# EAGLE design thpg (EAGLE 9.3.0)
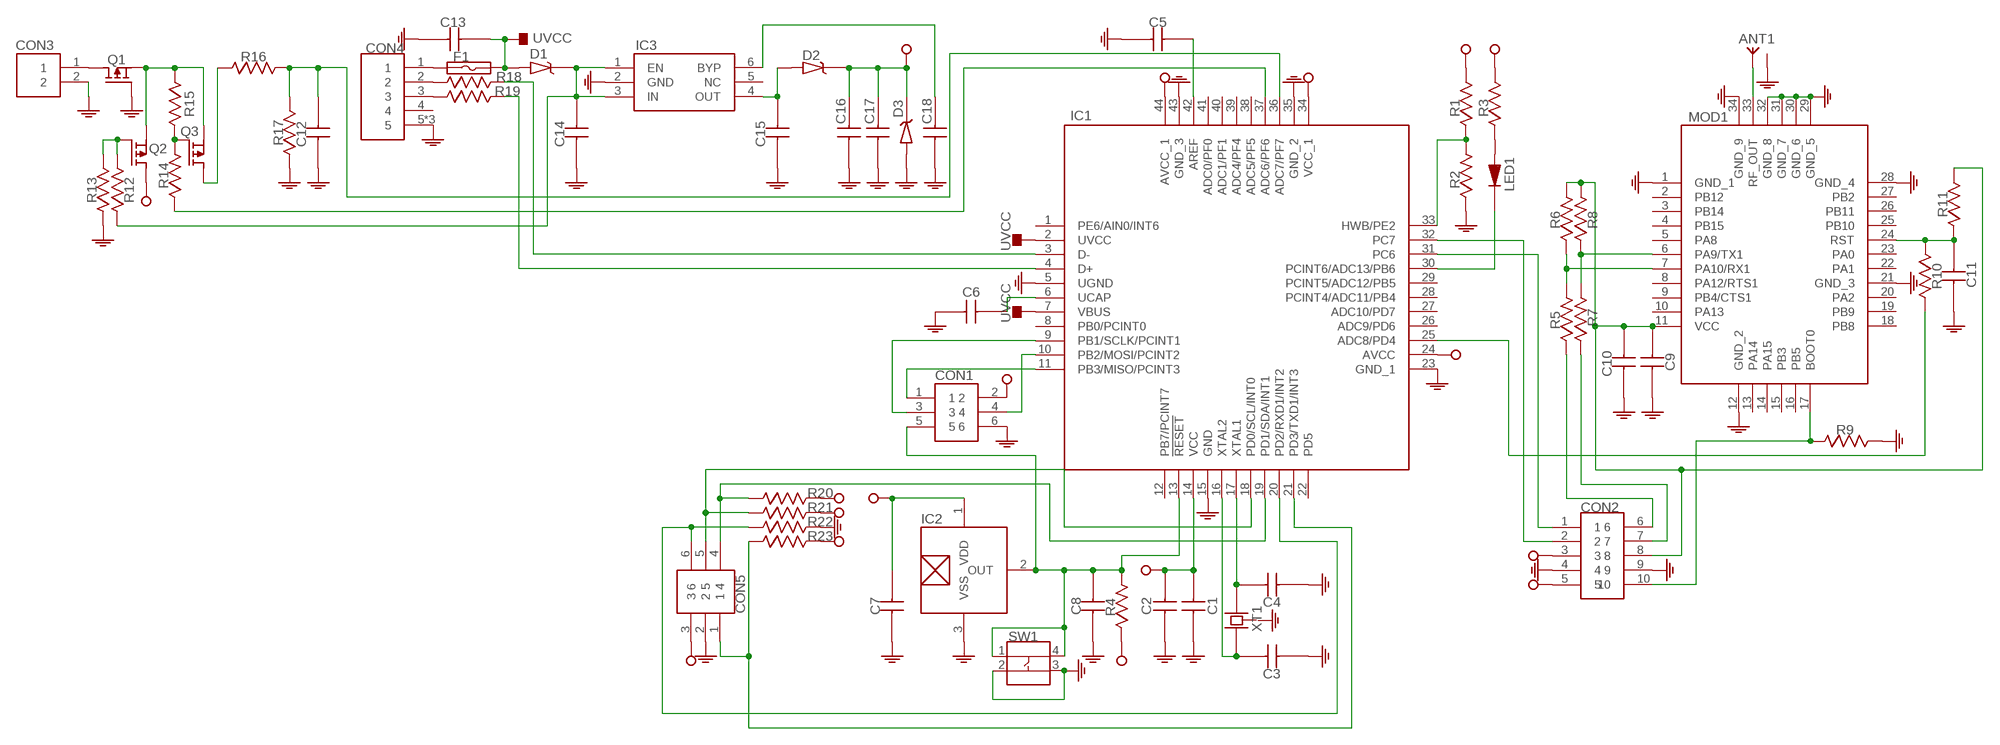
[diagram p0: schematic, sheet 1]

## Parts
ANT1  SMA-RF  [SMA-RF]
C1  CAPACITOR-0603  [0603]
C2  CAPACITOR-0603  [0603]
C3  CAPACITOR-0603  [0603]
C4  CAPACITOR-0603  [0603]
C5  CAPACITOR-0603  [0603]
C6  CAPACITOR-0603  [0603]
C7  CAPACITOR-0603  [0603]
C8  CAPACITOR-0603  [0603]
C9  CAPACITOR-0603  [0603]
C10  CAPACITOR-0603  [0603]
C11  CAPACITOR-0603  [0603]
C12  CAPACITOR-0603  [0603]
C13  CAPACITOR-0603  [0603]
C14  CAPACITOR-0805  [0805]
C15  CAPACITOR-0805  [0805]
C16  CAPACITOR-0603  [0603]
C17  CAPACITOR-0603  [0603]
C18  CAPACITOR-0603  [0603]
CON1  ISP  [ISP]
CON2  HEADER-10P-2R-DIP-2_54MM  [HEADER-10P-2R-DIP-2_54MM]
CON3  JST-PH-2-2.0MM  [JST-PH-2-2.0MM]
CON4  USB-MICRO-DIP-VER  [USB-MICRO-DIP-VER]
CON5  HEADER-6P-2R-DIP-2_54MM  [HEADER-6P-2R-DIP-2_54MM]
D1  DIODE-SCHOTTKY  [SOD123-DIODE]
D2  DIODE-SCHOTTKY  [SOD123-DIODE]
D3  ZENER-SOD123  [SOD123-DIODE]
F1  FUSE-0805  [0805]
IC1  ATMEGA32U4-MU  [QFN-44]
IC2  S-5712-SOT23-3  [SOT23-3]
IC3  MIC5219-VDFN-6  [VDFN-6]
LED1  LED-0603  [LED-0603]
MOD1  RAK811  [RAK811]
Q1  P-MOSFET  [SOT23-3]
Q2  P-MOSFET  [SOT23-3]
Q3  P-MOSFET  [SOT23-3]
R1  RESISTOR-0603  [0603]
R2  RESISTOR-0603  [0603]
R3  RESISTOR-0603  [0603]
R4  RESISTOR-0603  [0603]
R5  RESISTOR-0603  [0603]
R6  RESISTOR-0603  [0603]
R7  RESISTOR-0603  [0603]
R8  RESISTOR-0603  [0603]
R9  RESISTOR-0603  [0603]
R10  RESISTOR-0603  [0603]
R11  RESISTOR-0603  [0603]
R12  RESISTOR-0603  [0603]
R13  RESISTOR-0603  [0603]
R14  RESISTOR-0603  [0603]
R15  RESISTOR-0603  [0603]
R16  RESISTOR-0603  [0603]
R17  RESISTOR-0603  [0603]
R18  RESISTOR-0603  [0603]
R19  RESISTOR-0603  [0603]
R20  RESISTOR-0603  [0603]
R21  RESISTOR-0603  [0603]
R22  RESISTOR-0603  [0603]
R23  RESISTOR-0603  [0603]
SW1  BUTTON-4P-SMD-5X5  [BUTTON-4P-SMD-5X5]
XT1  CRYSTAL-5032-4P  [CRYSTAL-5032-4P]

## Nets
GND: ANT1.2(GND) ANT1.3(GND) ANT1.4(GND) ANT1.5(GND) C1.1 C2.1 C3.1 C4.1 C5.1 C6.1 C7.1 C8.1 C9.1 C10.1 C11.1 C12.1 C13.1 C14.1 C15.1 C16.1 C17.1 C18.1 CON1.6 CON2.4 CON2.9 CON3.2 CON4.5 CON4.6 CON4.7 CON5.2 D3.2(A) IC1.5(UGND) IC1.15(GND) IC1.23(GND_1) IC1.35(GND_2) IC1.43(GND_3) IC2.3(VSS) IC3.2(GND) MOD1.1(GND_1) MOD1.12(GND_2) MOD1.21(GND_3) MOD1.28(GND_4) MOD1.29(GND_5) MOD1.30(GND_6) MOD1.31(GND_7) MOD1.32(GND_8) MOD1.34(GND_9) Q1.1(G) R2.1 R9.2 R13.1 R17.1 R22.2 SW1.2 SW1.3
N$1: CON5.4 IC1.19(PD1/SDA/INT1) R20.1
N$2: C11.2 MOD1.24(RST) R10.1 R11.1
N$3: CON1.1 IC1.11(PB3/MISO/PCINT3)
N$4: ANT1.1(ANT) MOD1.33(RF_OUT)
N$6: MOD1.7(PA10/RX1) R5.2 R6.1
N$7: MOD1.6(PA9/TX1) R7.2 R8.1
N$9: CON1.4 IC1.10(PB2/MOSI/PCINT2)
N$10: C3.2 IC1.16(XTAL2) XT1.1
N$11: CON5.6 IC1.20(PD2/RXD1/INT2) R22.1
N$12: C4.2 IC1.17(XTAL1) XT1.3
N$13: C9.2 C10.2 CON2.8 MOD1.11(VCC) R6.2 R8.2 R11.2
N$14: CON2.7 R7.1
N$16: IC1.25(ADC8/PD4) R10.2
N$19: IC1.30(PCINT6/ADC13/PB6) LED1.1(K)
N$21: CON2.1 IC1.31(PC6)
N$22: CON5.5 IC1.18(PD0/SCL/INT0) R21.1
N$23: CON2.2 IC1.32(PC7)
N$25: CON5.1 IC1.21(PD3/TXD1/INT3) R23.1
N$31: C5.2 IC1.42(AREF)
N$32: Q3.1(G) R14.2 R15.2
N$33: CON4.1 F1.1
N$34: C6.2 IC1.6(UCAP)
N$35: LED1.2(A) R3.1
N$36: C12.2 IC1.36(ADC7/PF7) R16.2 R17.2
N$37: C18.2 IC3.6(BYP)
N$38: C14.2 D1.1(K) IC3.1(EN) IC3.3(IN) R12.1
N$40: C15.2 D2.2(A) IC3.4(OUT)
N$41: CON4.2 R18.1
N$42: CON4.3 R19.1
N$43: IC1.3(D-) R18.2
N$44: IC1.4(D+) R19.2
N$45: CON1.3 IC1.9(PB1/SCLK/PCINT1)
N$47: IC1.37(ADC6/PF6) R14.1
N$53: Q2.1(G) R12.2 R13.2
N$55: CON3.1 Q1.3(D)
N$58: Q1.2(S) Q2.2(S) Q3.2(S) R15.1
N$59: Q3.3(D) R16.1
N$60: CON2.6 R5.1
N$61: IC1.33(HWB/PE2) R1.1 R2.2
N$63: CON2.10 MOD1.17(BOOT0) R9.1
N$64: C8.2 CON1.5 IC1.13(!RESET) IC2.2(OUT) R4.2 SW1.1 SW1.4
UVCC: C13.2 D1.2(A) F1.2 IC1.2(UVCC) IC1.7(VBUS)
VCC: C1.2 C2.2 C7.2 C16.2 C17.2 CON1.2 CON2.3 CON2.5 CON5.3 D2.1(K) D3.1(K) IC1.14(VCC) IC1.24(AVCC) IC1.34(VCC_1) IC1.44(AVCC_1) IC2.1(VDD) Q2.3(D) R1.2 R3.2 R4.1 R20.2 R21.2 R23.2
Unconnected: CON4.4 IC1.1(PE6/AIN0/INT6) IC1.8(PB0/PCINT0) IC1.12(PB7/PCINT7) IC1.22(PD5) IC1.26(ADC9/PD6) IC1.27(ADC10/PD7) IC1.28(PCINT4/ADC11/PB4) IC1.29(PCINT5/ADC12/PB5) IC1.38(ADC5/PF5) IC1.39(ADC4/PF4) IC1.40(ADC1/PF1) IC1.41(ADC0/PF0) IC3.5(NC) MOD1.2(PB12) MOD1.3(PB14) MOD1.4(PB15) MOD1.5(PA8) MOD1.8(PA12/RTS1) MOD1.9(PB4/CTS1) MOD1.10(PA13) MOD1.13(PA14) MOD1.14(PA15) MOD1.15(PB3) MOD1.16(PB5) MOD1.18(PB8) MOD1.19(PB9) MOD1.20(PA2) MOD1.22(PA1) MOD1.23(PA0) MOD1.25(PB10) MOD1.26(PB11) MOD1.27(PB2)

## Power pins joined to a net without a drawn wire
GND: XT1.2(GND) XT1.4(GND)

## Library data of the parts
ANT1 = SamacSys_Parts:SMA-RF
C1-C13 C16-C18 = SamacSys_Parts:CAPACITOR-0603
C14 C15 = SamacSys_Parts:CAPACITOR-0805
CON1 = SamacSys_Parts:ISP
CON2 = SamacSys_Parts:HEADER-10P-2R-DIP-2_54MM
CON3 = SamacSys_Parts:JST-PH-2-2.0MM
CON4 = SamacSys_Parts:USB-MICRO-DIP-VER
CON5 = SamacSys_Parts:HEADER-6P-2R-DIP-2_54MM
D1 D2 = SamacSys_Parts:DIODE-SCHOTTKY
D3 = SamacSys_Parts:ZENER-SOD123
F1 = SamacSys_Parts:FUSE-0805
IC1 = SamacSys_Parts:ATMEGA32U4-MU
IC2 = SamacSys_Parts:S-5712-SOT23-3
IC3 = SamacSys_Parts:MIC5219-VDFN-6
LED1 = SamacSys_Parts:LED-0603
MOD1 = SamacSys_Parts:RAK811
Q1-Q3 = SamacSys_Parts:P-MOSFET
R1-R23 = SamacSys_Parts:RESISTOR-0603
SW1 = SamacSys_Parts:BUTTON-4P-SMD-5X5
XT1 = SamacSys_Parts:CRYSTAL-5032-4P

## Board
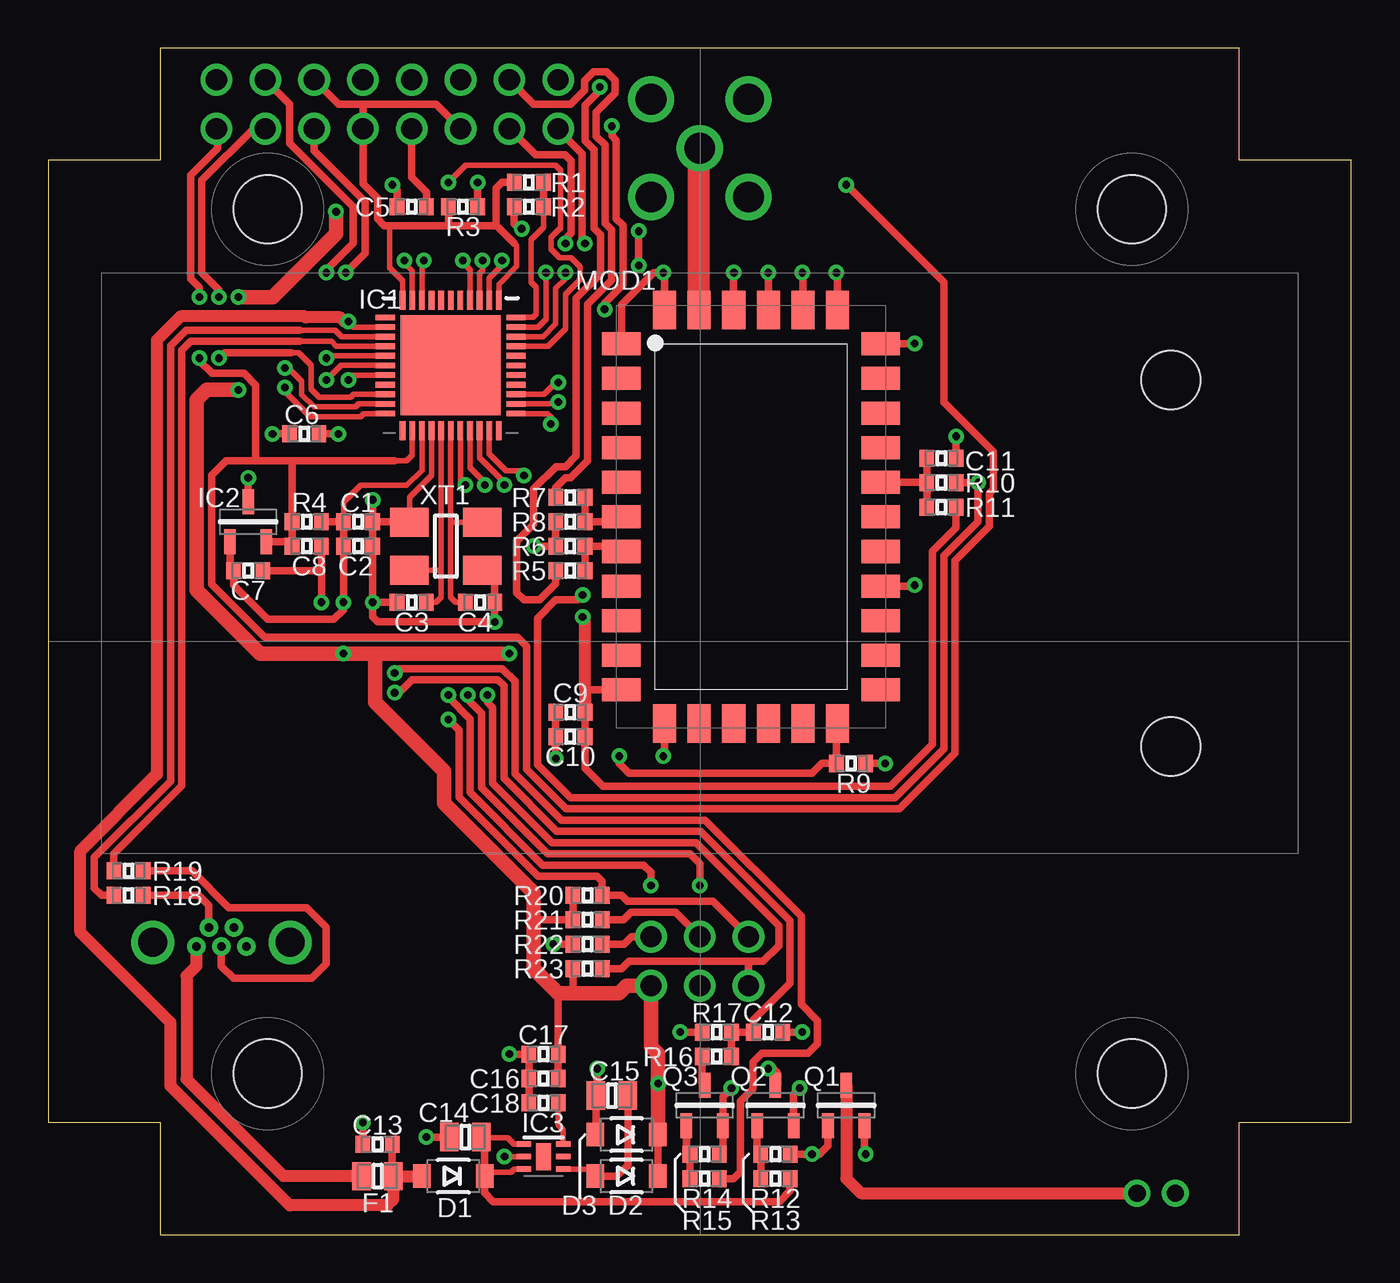
[diagram p1: board, top side]
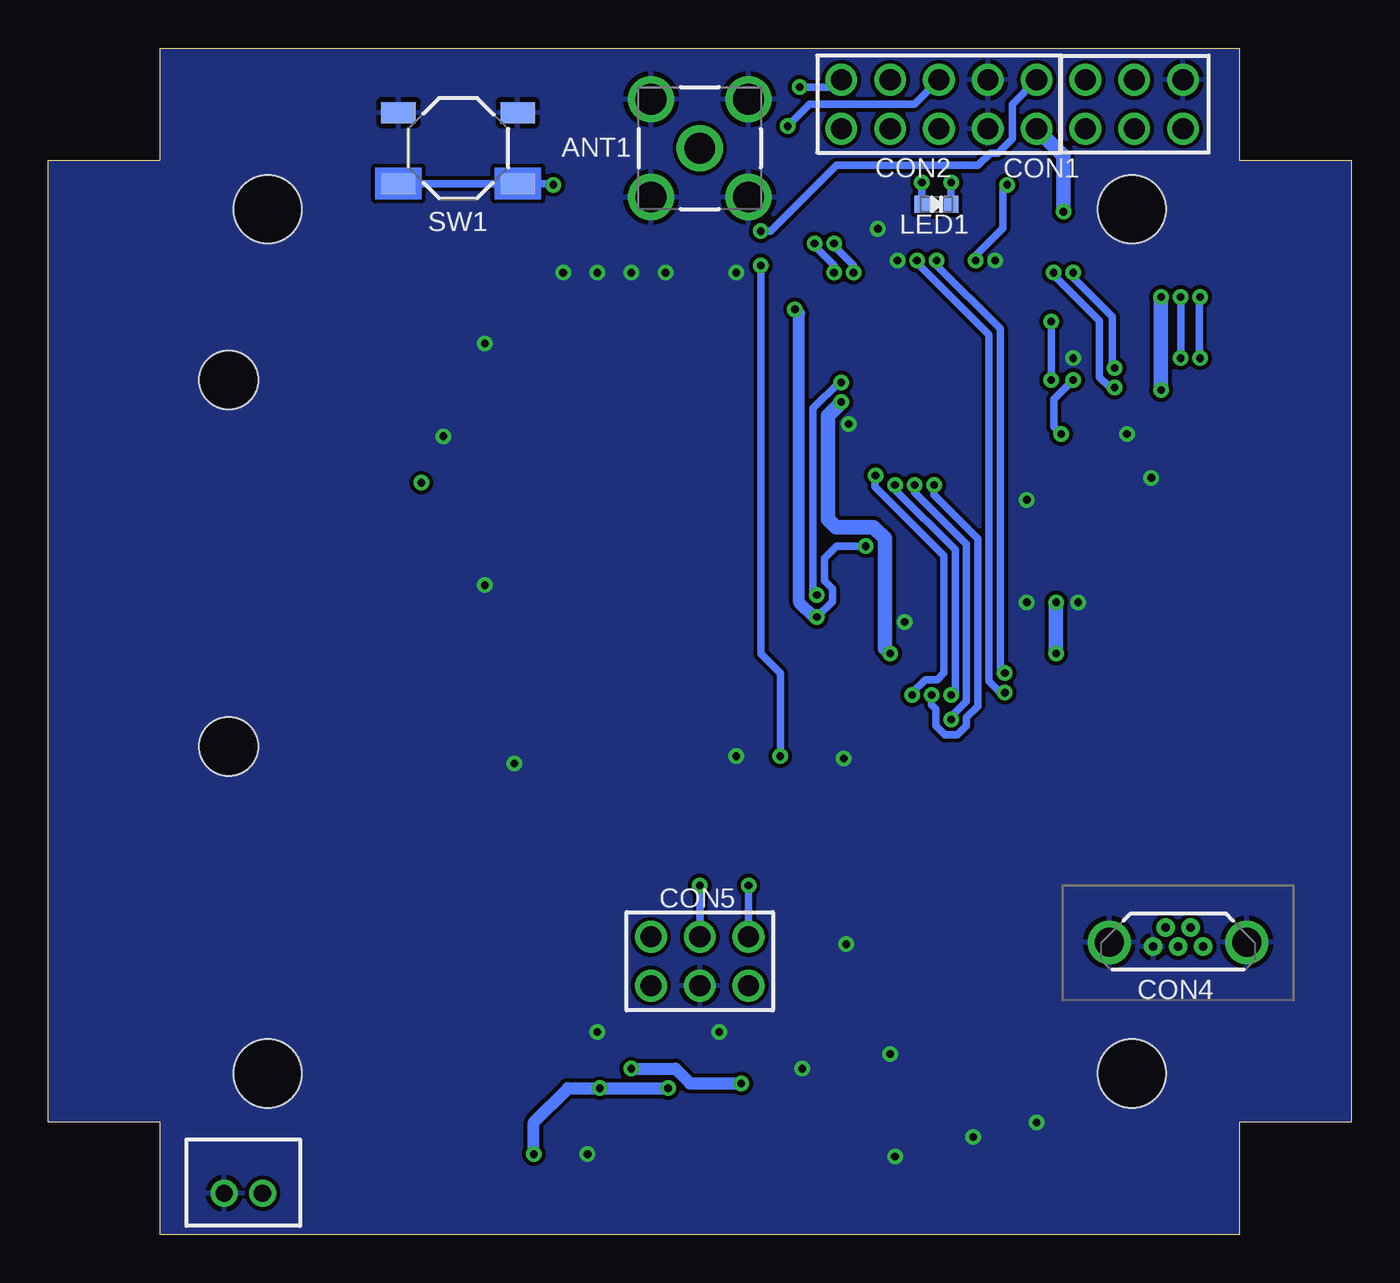
[diagram p2: board, bottom side, seen from below]

Size 67.82 x 61.72 mm. Coordinates in mm from the lower left corner, seen from the top.
Outline: 0,5.84 5.84,5.84 5.84,0 61.98,0 61.98,5.84 67.82,5.84 67.82,55.88 61.98,55.88 61.98,61.72 5.84,61.72 5.84,55.88 0,55.88 0,5.84
Copper layers (1*16): Top 0.035mm / dielectric 1.5mm / Bottom 0.035mm
Design rules "qfn": minimum track width 10mil, minimum drill 0.4mm, track to track 8mil, track to pad 10mil, pad to pad 8mil, via to via 8mil, smd to smd 0mil, copper to edge 0mil, drill to drill 6mil, minimum pad ring 10mil, minimum via ring 8mil, stop-mask expansion 4mil, vias tented up to drill 25mil, thermal gap 10mil
Holes 3.56 mm at 11.43,8.38 56.39,8.38 56.39,53.34 11.43,53.34
Holes 3.05 mm at 58.42,44.45 58.42,25.4
bRestrict: area 21.3,52.8 to 21.8,55

### Footprints (pad centres in the part's own frame; a part is rotated, then mirrored left to right if it is on the bottom)
SMA-RF = drill 1.6: 1 0,0; 2 -2.54,2.54; 3 -2.54,-2.54; 4 2.54,-2.54; 5 2.54,2.54
0603 = smd 0.762 x 0.889: 1 -0.762,0; 2 0.762,0
0805 = smd 0.97 x 1.47: 1 -0.83,0; 2 0.83,0
ISP = drill 1.1 pad 1.65: 1 0,0; 2 2.54,0; 3 0,-2.54; 4 2.54,-2.54; 5 0,-5.08; 6 2.54,-5.08
HEADER-10P-2R-DIP-2_54MM = drill 1.1 pad 1.65: 1 0,0; 2 2.54,0; 3 5.08,0; 4 7.62,0; 5 10.16,0; 6 0,2.54; 7 2.54,2.54; 8 5.08,2.54; 9 7.62,2.54; 10 10.16,2.54
JST-PH-2-2.0MM = drill 0.9: 1 -1,0; 2 1,0
USB-MICRO-DIP-VER = drill 0.45: 1 -1.3,0; 2 -0.65,-1; 3 0,0; 4 0.65,-1; 5 1.3,0 | drill 1.5: 6 -3.575,-0.22; 7 3.575,-0.22
HEADER-6P-2R-DIP-2_54MM = drill 1.1 pad 1.65: 1 -2.54,-1.27; 2 0,-1.27; 3 2.54,-1.27; 4 -2.54,1.27; 5 0,1.27; 6 2.54,1.27
SOD123-DIODE = smd 0.91 x 1.22: 1 -1.635,0; 2 1.635,0
QFN-44 = smd 1 x 0.3: 1 -3.4,2.5; 2 -3.4,2; 3 -3.4,1.5; 4 -3.4,1; 5 -3.4,0.5; 6 -3.4,0; 7 -3.4,-0.5; 8 -3.4,-1; 9 -3.4,-1.5; 10 -3.4,-2; 11 -3.4,-2.5; 23 3.4,-2.5; 24 3.4,-2; 25 3.4,-1.5; 26 3.4,-1; 27 3.4,-0.5; 28 3.4,0; 29 3.4,0.5; 30 3.4,1; 31 3.4,1.5; 32 3.4,2; 33 3.4,2.5 | smd 0.3 x 1: 12 -2.5,-3.4; 13 -2,-3.4; 14 -1.5,-3.4; 15 -1,-3.4; 16 -0.5,-3.4; 17 0,-3.4; 18 0.5,-3.4; 19 1,-3.4; 20 1.5,-3.4; 21 2,-3.4; 22 2.5,-3.4; 34 2.5,3.4; 35 2,3.4; 36 1.5,3.4; 37 1,3.4; 38 0.5,3.4; 39 0,3.4; 40 -0.5,3.4; 41 -1,3.4; 42 -1.5,3.4; 43 -2,3.4; 44 -2.5,3.4 | smd 5.2 x 5.2: 45 0,0
SOT23-3 = smd 1.3 x 0.6: 1 -1.05,0.95; 2 -1.05,-0.95; 3 1.05,0
VDFN-6 = smd 0.75 x 0.3: 1 -1.025,0.65; 2 -1.025,0; 3 -1.025,-0.65; 4 1.025,-0.65; 5 1.025,0; 6 1.025,0.65 | smd 0.8 x 1.4: 7 0,0
LED-0603 = smd 0.762 x 0.889: 1 -0.762,0; 2 0.762,0
RAK811 = smd 2 x 1.2: 1 -6.75,9; 2 -6.75,7.2; 3 -6.75,5.4; 4 -6.75,3.6; 5 -6.75,1.8; 6 -6.75,0; 7 -6.75,-1.8; 8 -6.75,-3.6; 9 -6.75,-5.4; 10 -6.75,-7.2; 11 -6.75,-9; 18 6.75,-9; 19 6.75,-7.2; 20 6.75,-5.4; 21 6.75,-3.6; 22 6.75,-1.8; 23 6.75,0; 24 6.75,1.8; 25 6.75,3.6; 26 6.75,5.4; 27 6.75,7.2; 28 6.75,9 | smd 1.2 x 2: 12 -4.5,-10.75; 13 -2.7,-10.75; 14 -0.9,-10.75; 15 0.9,-10.75; 16 2.7,-10.75; 17 4.5,-10.75; 29 4.5,10.75; 30 2.7,10.75; 31 0.9,10.75; 32 -0.9,10.75; 33 -2.7,10.75; 34 -4.5,10.75
BUTTON-4P-SMD-5X5 = smd 1.8 x 1.1: 1 -3.1,1.85; 2 -3.1,-1.85; 3 3.1,-1.85; 4 3.1,1.85
CRYSTAL-5032-4P = smd 2 x 1.5: 1 -1.9,-1.25; 2 1.9,-1.25; 3 1.9,1.25; 4 -1.9,1.25

### Placement (x,y rotation side)
ANT1  33.91,56.52 0 bottom
C1  16.13,37.08 180 top
C2  16.13,35.81 180 top
C3  18.92,32.89 0 top
C4  22.48,32.89 180 top
C5  18.92,53.47 180 top
C6  13.34,41.66 0 top
C7  10.41,34.54 180 top
C8  13.46,35.81 180 top
C9  27.18,27.18 0 top
C10  27.18,25.91 0 top
C11  46.48,40.39 180 top
C12  37.47,10.54 180 top
C13  17.14,4.7 0 top
C14  21.72,5.08 0 top
C15  29.34,7.24 0 top
C16  25.78,8.13 0 top
C17  25.78,9.4 0 top
C18  25.78,6.86 0 top
CON1  13.84,57.53 90 bottom
CON2  26.54,57.53 0 bottom
CON3  57.66,2.16 180 bottom
CON4  9.02,14.99 180 bottom
CON5  33.91,14.22 0 bottom
D1  21.08,3.05 180 top
D2  30.1,3.05 180 top
D3  30.1,5.21 180 top
F1  17.14,3.05 0 top
IC1  20.95,45.21 0 top
IC2  10.41,37.08 90 top
IC3  25.78,4.06 0 top
LED1  21.59,53.59 180 bottom
MOD1  36.58,37.34 0 top
Q1  41.53,6.73 90 top
Q2  37.85,6.73 90 top
Q3  34.16,6.73 90 top
R1  25.02,54.74 180 top
R2  25.02,53.47 0 top
R3  21.59,53.47 180 top
R4  13.46,37.08 180 top
R5  27.18,34.54 0 top
R6  27.18,35.81 180 top
R7  27.18,38.35 0 top
R8  27.18,37.08 180 top
R9  41.78,24.51 0 top
R10  46.48,39.12 0 top
R11  46.48,37.85 0 top
R12  37.85,2.92 180 top
R13  37.85,4.19 180 top
R14  34.16,2.92 180 top
R15  34.16,4.19 180 top
R16  34.8,9.27 0 top
R17  34.8,10.54 0 top
R18  4.19,17.65 180 top
R19  4.19,18.92 180 top
R20  28.07,17.65 180 top
R21  28.07,16.38 180 top
R22  28.07,15.11 180 top
R23  28.07,13.84 180 top
SW1  46.48,56.52 180 bottom
XT1  20.7,35.81 0 top

### Tracks (layer width: path | path; a pad name or v marks a point on that pad's centre or on a via)
GND  (via drill 0.4)
  Top 0.292: IC3.2 v23.75,4.06 | IC1.15 19.95,39.51 18.8,38.36 XT1.4 18.8,37.08 | IC1.5 14.6,45.71 v14.48,45.59 | IC1.35 22.95,49.75 23.62,50.42 v23.62,50.67 | IC1.23 26,42.71 26.16,42.55 v26.16,42.16 | IC1.43 18.95,50.13 18.54,50.55 v18.54,50.67
  Top 0.381: D3.2 28.51,5.25 C15.1 28.57,7.31 v28.57,8.64 | C18.1 C16.1 C17.1 v24,9.4 | C14.1 v19.68,5.08 | R13.1 v39.75,4.19 40.13,4.19 40.58,4.64 Q1.1 | XT1.2 23.1,35.06 23.24,34.92 C4.1 v23.24,31.88 17.14,31.88 16.89,32.13 v16.89,32.89 | C1.1 18.8,37.08 | C1.1 C2.1 v16.89,32.89 | C8.1 14.22,34.54 | 14.22,34.54 v14.22,32.89 | MOD1.34 32.08,49.97 v32,50.04 31.5,50.04 29.83,48.37 MOD1.1 | MOD1.32 35.68,50.03 v35.69,50.04 | MOD1.31 37.48,50.03 v37.47,50.04 | MOD1.30 39.28,50.01 v39.24,50.04 | MOD1.29 41.08,49.98 v41.02,50.04 | MOD1.28 45.07,46.34 v45.09,46.35 | MOD1.21 45.04,33.74 v45.09,33.78 | MOD1.12 32.08,24.96 v32,24.89 | IC2.3 v10.41,39.37 | C11.1 v47.24,41.53 | C9.1 C10.1 v26.42,24.77 | R9.2 v43.56,24.51 | C5.1 19.68,54.23 18.92,54.99 CON2.4 | R2.1 24.26,52.58 24.51,52.32 v24.64,52.32 | v39.24,10.54 C12.1 | v32.89,10.54 R17.1 | C6.1 v11.68,41.66 | C7.1 14.22,34.54 | C3.1 v16.89,32.89 | C1.1 v16.89,38.23 | C13.1 v16.38,5.84 | R22.2 v26.29,15.11
  pour Bottom: 0.13,5.97 0.13,55.75 5.97,55.75 5.97,61.59 61.85,61.59 61.85,55.75 67.69,55.75 67.69,5.97 61.85,5.97 61.85,0.13 5.97,0.13 5.97,5.97
N$1  (via drill 0.4)
  Top 0.292: IC1.19 21.95,39.89 22.73,39.12 v22.73,38.99
  Top 0.381: CON5.4 34.59,17.35 30.15,17.35 29.84,17.65 R20.1 28.83,18.39 28.57,18.64 25.5,18.64 21.38,22.76 21.38,26.24 v20.83,26.8
  Bottom 0.381: v22.73,38.99 22.73,38.62 20.03,35.92 20.03,27.74 20.83,26.94 v20.83,26.8
N$2
  Top 0.381: C11.2 R10.1 | R10.1 R11.1 | MOD1.24 45.7,39.14 R10.1
N$3  (via drill 0.4)
  Top 0.292: IC1.11 16.42,42.71 16.26,42.55 13.59,42.55 13.59,42.61 12.32,43.88 v12.32,44.07
  Top 0.381: CON1.1 13.84,56.39 16.51,53.72 16.51,51.05 v15.49,50.04
  Bottom 0.381: v12.32,44.07 12.57,44.07 13.12,44.61 13.12,47.53 15.49,49.91 v15.49,50.04
N$4
  Top 1.143: MOD1.33 33.88,56.48 ANT1.1
N$6
  Top 0.381: MOD1.7 29.55,35.81 R6.1 R5.2
N$7
  Top 0.381: MOD1.6 29.57,37.08 R8.1 R7.2
N$9  (via drill 0.4)
  Top 0.292: IC1.10 16.16,43.21 16,43.05 13.84,43.05 13.2,43.7 13.2,44.38 12.49,45.09 v12.32,45.09
  Top 0.381: v14.48,50.04 14.48,50.16 15.88,51.56 15.88,53.47 12.57,56.77 12.57,58.8 CON1.4
  Bottom 0.381: v12.32,45.09 12.45,45.21 12.45,47.75 14.48,49.78 v14.48,50.04
N$10
  Top 0.292: IC1.16 20.45,34.56 | 20.45,34.56 20.45,33.16 20.19,32.89 C3.2 | XT1.1 20.45,34.56
N$11  (via drill 0.4)
  Top 0.292: IC1.20 22.45,40.41 23.75,39.12 v23.75,38.99
  Top 0.381: v31.37,18.16 31.37,18.85 30.99,19.23 25.74,19.23 21.96,23 21.96,26.82 20.83,27.96 v20.83,28.07 | R22.1 29.97,15.11 30.35,15.49 CON5.6
  Bottom 0.381: v23.75,38.99 23.75,38.75 20.61,35.62 20.61,28.28 v20.83,28.07 | v31.37,18.16 CON5.6
N$12
  Top 0.292: C4.2 21.21,32.89 20.95,33.15 20.95,37.08 | IC1.17 20.95,37.08 | XT1.3 20.98,37.06 20.95,37.08
N$13  (via drill 0.4)
  Top 0.381: C9.2 C10.2 27.94,24.26 28.86,23.33 43.84,23.33 46.02,25.52 46.02,35.55 47.24,36.77 R11.2 | R8.2 R6.2 v25.27,35.81 | v28.96,48.13 28.96,48.45 29.91,49.4 29.91,52.5 29.57,52.84 29.57,56.92 29.34,57.15 v29.34,57.66 | MOD1.11 28.05,28.34 27.94,28.45
  Top 0.635: C9.2 27.94,28.45 27.94,32 v27.81,32.13
  Bottom 0.381: v29.34,57.66 28.19,58.8 22.73,58.8 CON2.8 | v25.27,35.81 26.8,35.81 27.43,35.18 27.43,34.02 27.02,33.6 27.02,32.93 v27.81,32.13
  Bottom 0.635: v28.96,48.13 28.74,47.91 28.74,32.89 27.98,32.13 v27.81,32.13
N$14
  Top 0.381: CON2.7 25.27,58.8 27.18,58.8 27.91,59.53 27.91,60.02 28.37,60.49 29.05,60.49 29.5,60.04 29.5,59.36 28.52,58.38 28.52,57.14 28.98,56.68 28.98,52.6 29.32,52.26 29.32,49.64 28.07,48.39 28.07,40.26 27.18,39.37 26.92,39.37 26.42,38.86 R7.1
N$16  (via drill 0.4)
  Top 0.292: v26.54,44.32 26.42,44.32 25.8,43.71 IC1.25
  Top 0.381: R10.2 v48.39,39.12 48.39,37.08 46.61,35.31 46.61,25.27 44.07,22.73 27.19,22.73 25.47,24.46 25.47,32.08 26.42,33.02 27.56,33.02 v27.81,33.27
  Bottom 0.381: v27.81,33.27 28.02,33.48 28.02,42.98 26.67,44.32 v26.54,44.32
N$19  (via drill 0.4)
  Top 0.292: IC1.30 26.02,46.21 26.92,47.12 26.92,48.91 27.68,49.66 27.68,50.35 27.22,50.81 26.61,50.81 26.17,51.25 26.17,51.87 26.61,52.31 26.66,52.31 26.67,52.32 26.67,55.37 26.42,55.63 21.72,55.63 v20.83,54.74
  Bottom 0.381: LED1.1 v20.83,54.74
N$21  (via drill 0.4)
  Top 0.292: IC1.31 25.76,46.71 26.42,47.37 26.42,49.23 26.92,49.74 v26.92,50.04
  Top 0.381: v27.94,51.56 27.79,51.71 27.79,56.22 26.54,57.47 CON2.1
  Bottom 0.381: v26.92,50.04 26.92,50.42 27.94,51.44 v27.94,51.56
N$22  (via drill 0.4)
  Top 0.292: IC1.18 21.45,39.25 v21.72,38.99
  Top 0.381: v33.91,18.16 33.91,19.3 33.4,19.81 25.98,19.81 22.55,23.25 22.55,27.12 21.84,27.83 v21.84,28.07 | R21.1 29.95,16.38 30.34,16.76 32.64,16.76 CON5.5
  Bottom 0.381: v21.72,38.99 21.72,38.48 19.45,36.21 19.45,27.5 20.03,26.91 20.03,26.47 20.5,26 21.16,26 21.62,26.47 21.62,27.34 21.84,27.56 v21.84,28.07 | v33.91,18.16 CON5.5
N$23  (via drill 0.4)
  Top 0.292: IC1.32 25.5,47.21 25.91,47.62 v25.91,50.04
  Top 0.381: v26.92,51.56 27.05,51.69 27.05,51.94 27.21,52.1 27.21,55.85 26.89,56.17 25.37,56.17 CON2.2
  Bottom 0.381: v25.91,50.04 25.91,50.42 26.92,51.44 v26.92,51.56
N$25  (via drill 0.4)
  Top 0.292: v24.77,39.5 24.77,39.55 24.57,39.74 23.82,39.74 22.95,40.61 IC1.21
  Top 0.381: 36.45,14.22 37.21,14.22 38.02,15.04 38.02,16.08 33.7,20.4 26.23,20.4 23.13,23.49 23.13,27.41 22.86,27.69 v22.86,28.07 | 36.45,14.22 30.23,14.22 29.84,13.84 R23.1 | CON5.1 36.45,14.22
  Bottom 0.381: v24.77,39.5 24.8,39.46 24.8,38.91 21.2,35.31 21.2,29.22 21.55,28.86 22.17,28.86 22.86,28.18 v22.86,28.07
N$31  (via drill 0.4)
  Top 0.292: v19.56,50.67 19.56,50.42 19.45,50.32 IC1.42
  Top 0.381: v17.91,54.61 18.16,54.36 C5.2
  Bottom 0.381: v19.56,50.67 19.56,50.93 18.13,52.36 18.13,54.39 v17.91,54.61
N$32
  Top 0.381: R14.2 R15.2 33.21,4.38 Q3.1
N$33
  Top 0.635: CON4.1 7.72,13.97 7.21,13.46 7.21,8.09 12.25,3.05 F1.1
N$34  (via drill 0.4)
  Top 0.292: IC1.6 15.24,45.21 v14.48,44.45
  Top 0.381: v15.11,41.66 C6.2
  Bottom 0.381: v15.11,41.66 15.13,41.66 15.49,42.02 15.49,43.45 14.49,44.45 v14.48,44.45
N$35  (via drill 0.4)
  Top 0.381: R3.1 v22.35,54.74
  Bottom 0.381: LED1.2 v22.35,54.74
N$36  (via drill 0.4)
  Top 0.292: v22.61,50.67 22.61,50.16 22.45,50.01 IC1.36
  Top 0.381: R16.2 R17.2 C12.2 36.7,11.18 38.61,13.08 38.61,16.32 33.95,20.98 26.47,20.98 23.72,23.73 23.72,28.54 23.39,28.87 18.95,28.87 18.27,28.19 v18.03,28.19
  Bottom 0.381: v22.61,50.67 22.61,50.56 18.86,46.81 18.86,28.78 18.27,28.19 v18.03,28.19
N$37
  Top 0.292: IC3.6 26.81,5.45 26.54,5.71 C18.2
N$38
  Top 0.292: D1.1 22.93,3.26 24.08,3.26 24.23,3.41 IC3.3 | IC3.1 24.23,4.71 23.91,5.04 22.59,5.04
  Top 0.381: C14.2 22.59,5.04 22.72,4.91 D1.1 22.72,2.17 23.16,1.73 38.05,1.73 38.61,2.29 R12.1
N$40
  Top 0.292: IC3.4 28.1,3.41 D2.2
  Top 0.381: D2.2 29.59,3.05 30.17,3.62 C15.2
N$41
  Top 0.381: CON4.2 8.37,17.13 7.84,17.65 R18.1
N$42
  Top 0.381: CON4.3 9.02,13.97 9.65,13.34 13.72,13.34 14.48,14.1 14.48,16 13.46,17.02 9.4,17.02 7.49,18.92 R19.1
N$43
  Top 0.292: IC1.3 15.26,46.71 14.93,47.05 13.08,47.05
  Top 0.381: 13.08,47.05 7.18,47.05 6.38,46.24 6.38,23.59 2.41,19.62 2.41,18.03 2.79,17.65 R18.2
N$44
  Top 0.292: IC1.4 15,46.21 14.75,46.47 13.08,46.47
  Top 0.381: 13.08,46.47 7.43,46.47 6.96,46 6.96,23.34 3.43,19.81 R19.2
N$45  (via drill 0.4)
  Top 0.292: IC1.9 15.9,43.71 15.75,43.56 14.1,43.56 13.69,43.96 13.69,45.23 13.05,45.88 12.65,45.88
  Top 0.381: v8.89,48.77 8.89,49.15 8,50.04 8,54.85 10.69,57.53 CON1.3 | 12.65,45.88 9.18,45.88 v8.89,45.59
  Bottom 0.381: v8.89,45.59 8.88,45.61 8.88,48.76 v8.89,48.77
N$47  (via drill 0.4)
  Top 0.292: IC1.37 21.95,50.18 21.59,50.55 v21.59,50.67
  Top 0.381: R14.1 35.67,2.92 36.02,3.28 36.02,6.95 36.67,7.59 36.67,8.97 37.13,9.43 39.53,9.43 40.04,9.94 40.04,11.14 39.19,11.99 39.19,16.56 34.19,21.57 26.71,21.57 24.3,23.97 24.3,28.78 23.64,29.45 18.27,29.45 v18.03,29.21
  Bottom 0.381: v21.59,50.67 21.59,50.44 18.27,47.12 18.27,29.45 v18.03,29.21
N$53
  Top 0.381: Q2.1 36.9,4.38 R13.2 R12.2
N$55
  Top 0.635: Q1.3 41.53,2.92 42.29,2.16 CON3.1
N$58  (via drill 0.4)
  Top 0.381: R15.1 35.11,4.38 Q3.2 35.11,7.17 v35.56,7.62 | Q2.2 38.8,7.3 v39.12,7.62 | v42.55,4.19 42.48,4.26 Q1.2
  Bottom 0.635: v35.56,7.62 v39.12,7.62 40.77,7.62 42.55,5.84 v42.55,4.19
N$59
  Top 0.381: R16.1 34.04,7.91 Q3.3
N$60  (via drill 0.4)
  Top 0.381: v28.7,59.69 28.7,59.5 27.94,58.74 27.94,56.9 28.4,56.44 28.4,52.36 28.74,52.02 28.74,49.96 27.48,48.71 27.48,40.51 26.92,39.95 26.43,39.95 25.27,38.79 25.27,36.96 24.38,36.07 24.38,33.4 24.77,33.02 25.58,33.02 26.42,33.86 R5.1
  Bottom 0.381: v28.7,59.69 26.92,59.69 CON2.6
N$61
  Top 0.292: IC1.33 25.23,47.71 25.4,47.88 25.4,49.28 25.13,49.54 25.13,51.76 25.78,52.4 R2.2
  Top 0.381: R1.1 R2.2
N$63  (via drill 0.4)
  Top 0.381: MOD1.17 41.02,26.53 R9.1 40.26,24.51 39.75,24 30.23,24 29.72,24.51 v29.72,24.89 | v30.73,50.42 v30.73,52.2
  Bottom 0.381: CON2.10 17.65,58.8 17.65,57.01 18.4,56.26 18.8,56.26 19.43,55.63 26.8,55.63 30.23,52.2 v30.73,52.2 | v30.73,50.42 30.73,30.23 29.72,29.21 v29.72,24.89
N$64  (via drill 0.4)
  Top 0.292: IC1.13 18.95,40.55 18.67,40.26 18.03,40.26
  Top 0.381: IC2.2 12.48,36.03 C8.2 R4.2 12.7,40.26 | CON1.5 8.81,57.48 8.81,56.5 7.42,55.11 7.42,49.73 7.87,49.28 v7.87,48.77 | v41.53,54.61 46.61,49.53 46.61,43.31 49.18,40.73 49.18,38.79 48.97,38.57 48.97,36.84 47.19,35.06 47.19,25.03 44.31,22.15 26.95,22.15 24.89,24.21 24.89,30.61 24.42,31.08 11.27,31.08 8.51,33.84 8.51,39.5 9.27,40.26 10.79,40.26 | 18.03,40.26 12.7,40.26 | 10.79,40.26 12.7,40.26 | 10.79,40.26 10.79,44.2 10.2,44.8 8.54,44.8 7.87,45.47 v7.87,45.59
  Bottom 0.381: SW1.4 SW1.1 41.58,54.66 v41.53,54.61 | v7.87,45.59 7.87,45.7 7.91,45.74 7.91,48.77 v7.87,48.77
UVCC  (via drill 0.4)
  Top 0.292: IC1.7 15.88,44.71 v15.62,44.45 | IC1.2 15.91,47.21 v15.62,47.5
  Top 0.381: C13.2 17.91,3.12 F1.2
  Top 0.635: D1.2 F1.2 17.98,1.85 17.65,1.52 12.57,1.52 6.37,7.73 6.37,11.03 1.68,15.72 1.68,19.95 5.66,23.94 5.66,46.54 6.89,47.76 13.38,47.76 13.42,47.72 15.2,47.72 15.42,47.5 v15.62,47.5
  Bottom 0.381: v15.62,47.5 v15.62,44.45
VCC  (via drill 0.4)
  Top 0.292: IC1.14 19.45,39.77 18.67,38.99 16.26,38.99 15.37,38.1 C1.2 | v26.54,43.31 26.45,43.21 IC1.24 | IC1.34 23.45,49.44 24.38,50.37 24.38,51.44 24.26,51.56 | IC1.44 18.45,49.62 17.77,50.3 17.77,52.49
  Top 0.381: C16.2 C17.2 26.54,12.57 | D2.1 D3.1 | R4.1 C1.2 C2.2 v15.37,32.89 15.37,32.51 14.86,32 11.43,32 9.65,33.78 C7.2 9.46,34.73 IC2.1 | CON1.2 15.11,58.8 16.38,58.8 | 16.38,58.8 CON2.5 16.38,54.67 17.14,53.91 17.14,52.83 17.49,52.49 17.77,52.49 20.83,52.49 | v31.75,7.87 31.73,7.89 31.73,8.89 | 23.3,52.49 23.33,52.49 24.26,51.56 | 23.3,52.49 20.83,52.49 | R1.2 23.62,54.74 23.3,54.42 23.3,52.49 | R3.2 20.83,52.49 | CON2.3 20.19,58.8 16.38,58.8 | R20.2 R21.2 25.27,16.38 | R23.2 27.3,12.57
  Top 0.635: v37.47,8.64 37.59,8.64 37.85,8.38 Q2.3
  Top 0.762: D3.1 31.73,8.89 31.73,9.41 31.37,9.78 CON5.3 30.1,12.95 29.72,12.57 27.3,12.57 26.54,12.57 25.27,13.84 25.27,16.38 25.27,17.77 20.61,22.44 20.61,24.1 17.02,27.69 17.02,30.23 | 17.02,30.23 v15.37,30.23 11.03,30.23 7.73,33.52 7.73,43.42 8.26,43.94 v9.91,43.94 | 17.02,30.23 v24,30.23 | v9.91,48.77 11.68,48.77 14.99,52.07 v14.99,53.21
  Bottom 0.635: v37.47,8.64 35.18,8.64 34.42,7.87 v31.75,7.87
  Bottom 0.762: v24,30.23 24.29,30.51 24.29,36.22 24.86,36.8 26.83,36.8 27.24,37.21 27.24,42.61 v26.54,43.31 | v15.37,32.89 v15.37,30.23 | CON2.5 14.99,56.13 v14.99,53.21 | v9.91,48.77 v9.91,43.94
(copper drawn outside any net)
  shapes: Bottom area x2